# EAGLE design tx (EAGLE 6.5.0)
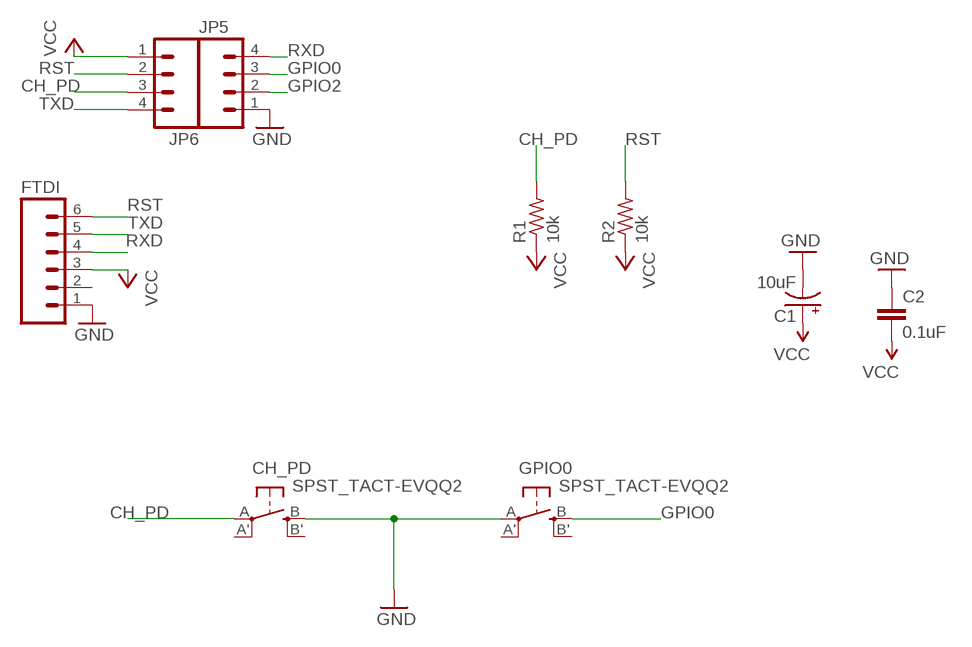
[diagram p0: schematic, sheet 1]

## Parts
C1  10uF  CAP_POL6032  [EIA6032]
C2  0.1uF  0.1UF-100V-10%(0603)  [0603-CAP]
CH_PD  SPST_TACT-EVQQ2  [EVQ-Q2]
FTDI  M06SILK_FEMALE_PTH  [1X06]
GPIO0  SPST_TACT-EVQQ2  [EVQ-Q2]
JP5  M041X04_NO_SILK  [1X04_NO_SILK]
JP6  M041X04_NO_SILK  [1X04_NO_SILK]
R1  10k  R-US_R0805  [R0805]
R2  10k  R-US_R0805  [R0805]

## Nets
CH_PD: CH_PD.A(P) JP6.3 R1.2
GND: C1.P$2(-) C2.1 CH_PD.B(S) FTDI.1 GPIO0.A(P) JP5.1
GPIO0: GPIO0.B(S) JP5.3
GPIO2: JP5.2
RST: FTDI.6 JP6.2 R2.2
RXD: FTDI.4 JP5.4
TXD: FTDI.5 JP6.4
VCC: C1.P$1(+) C2.2 FTDI.3 JP6.1 R1.1 R2.1
Unconnected: CH_PD.A'(P1) CH_PD.B'(S1) FTDI.2 GPIO0.A'(P1) GPIO0.B'(S1)

## Library data of the parts
C1 = SparkFun-Capacitors:CAP_POL: Capacitor Polarized These are standard SMD and PTH capacitors. Normally 10uF, 47uF, and 100uF in electrolytic and tantalum varieties. Always verify the external diameter of the through hole cap, it varies with capacity, voltage, and manufacturer. The EIA devices should be standard.
C2 = SparkFun-Capacitors:0.1UF-100V-10%(0603): CAP-08390; PROD_ID: CAP-08390
CH_PD GPIO0 = adafruit:SPST_TACT: SMT 6mm switch, EVQQ2 series http://www.ladyada.net/library/eagle
FTDI = SparkFun-Connectors:M06: Header 6 Standard 6-pin 0.1" header. Use with straight break away headers (SKU : PRT-00116), right angle break away headers (PRT-00553), swiss pins (PRT-00743), machine pins (PRT-00117), and female headers (PRT-00115). Molex polarized connector foot print use with SKU : PRT-08094 with associated crimp pins and housings. NOTES ON THE VARIANTS LOCK and LOCK_LONGPADS... This footprint was designed to help hold the alignment of a through-hole component (i.e. 6-pin header) while soldering it into place. You may notice that each hole has been shifted either up or down by 0.005 of an inch from it's more standard position (which is a perfectly straight line). This slight alteration caused the pins (the squares in the middle) to touch the edges of the holes. Because they are alternating, it causes a "brace" to hold the component in place. 0.005 has proven to be the perfect amount of "off-center" position when using our standard breakaway headers. Although looks a little odd when you look at the bare footprint, once you have a header in there, the alteration is very hard to notice. Also,if you push a header all the way into place, it is covered up entirely on the bottom side. This idea of altering the position of holes to aid alignment will be further integrated into the Sparkfun Library for other footprints. It can help hold any component with 3 or more connection pins.; PROD_ID: CONN-08437
JP5 JP6 = SparkFun-Connectors:M04: Header 4 Standard 4-pin 0.1" header. Use with straight break away headers (SKU : PRT-00116), right angle break away headers (PRT-00553), swiss pins (PRT-00743), machine pins (PRT-00117), and female headers (PRT-00115). Molex polarized connector foot print use with SKU : PRT-08231 with associated crimp pins and housings. 1MM SMD Version SKU: PRT-10208
R1 R2 = adafruit:R-US_: RESISTOR, American symbol

## Board
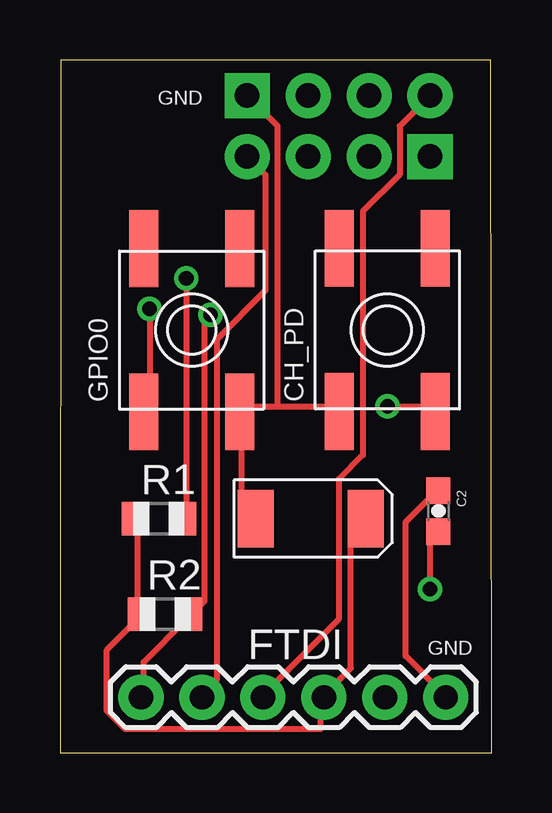
[diagram p1: board, top side]
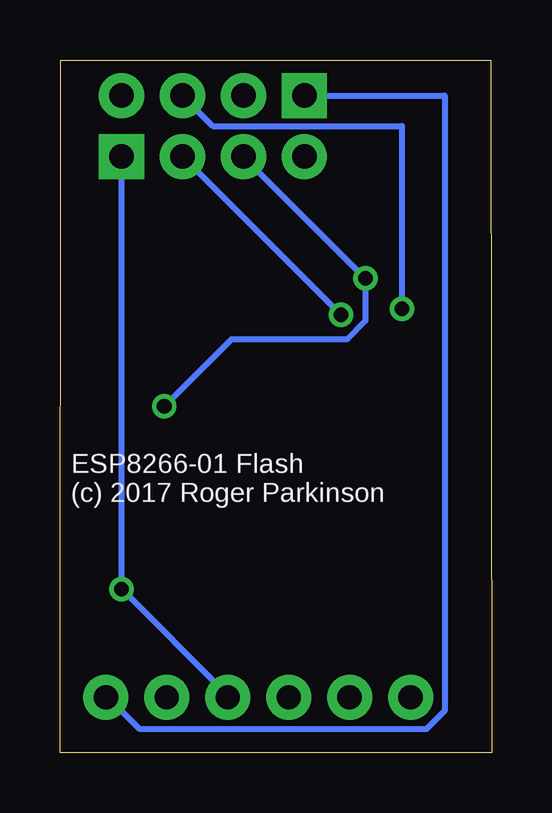
[diagram p2: board, bottom side, seen from below]

Size 17.98 x 28.89 mm. Coordinates in mm from the lower left corner, seen from the top.
Outline: 0,0 17.98,0.01 17.95,28.88 0.03,28.89 0,0
Copper layers (1*16): Top 0.035mm / dielectric 1.5mm / Bottom 0.035mm
Design rules "default": minimum track width 10mil, minimum drill 24mil, track to track 8mil, track to pad 8mil, pad to pad 8mil, via to via 8mil, smd to smd 8mil, copper to edge 40mil, drill to drill 8mil, minimum pad ring 10mil, minimum via ring 8mil, stop-mask expansion 4mil, vias tented up to drill 0mil, thermal gap 10mil

### Footprints (pad centres in the part's own frame; a part is rotated, then mirrored left to right if it is on the bottom)
EIA6032 = smd 1.5 x 2.4: P$1 -2.3,0; P$2 2.3,0
0603-CAP = smd 1.1 x 1: 1 -0.85,0; 2 0.85,0
EVQ-Q2 = smd 3.2 x 1.2: A -3.4,-2; A' 3.4,-2; B -3.4,2; B' 3.4,2
1X06 = drill 1.016 pad 1.88: 1 0,0; 2 2.54,0; 3 5.08,0; 4 7.62,0; 5 10.16,0; 6 12.7,0
1X04_NO_SILK = drill 1.016 pad 1.88 square: 1 0,0 | drill 1.016 pad 1.88: 2 2.54,0; 3 5.08,0; 4 7.62,0
R0805 = smd 1.1 x 1.4: 1 -1,0; 2 1,0

### Placement (x,y rotation side)
C1  10.45,9.77 180 top
C2  15.76,10.08 270 top
CH_PD  13.64,17.64 90 top
FTDI  16.07,2.32 180 top
GPIO0  5.48,17.63 90 top
JP5  7.8,27.41 0 top
JP6  15.42,24.87 180 top
R1  4.13,9.76 0 top
R2  4.38,5.78 0 top

### Tracks (layer width: path | path; a pad name or v marks a point on that pad's centre or on a via)
CH_PD  (via drill 0.61)
  Top 0.254: v5.26,19.79 5.26,9.88 R1.2 | v13.64,14.45 15.42,14.45 CH_PD.A
  Bottom 0.254: JP6.3 v5.26,19.79 5.26,18.01 6.02,17.25 10.85,17.25 v13.64,14.45
GND
  Top 0.254: C2.1 15.67,10.9 14.4,9.63 14.4,4.04 15.93,2.51 FTDI.1 | C1.P$2 8.05,9.88 7.54,10.39 7.54,14.2 GPIO0.A 7.54,14.45 9.07,14.45 | 9.07,14.45 11.61,14.45 CH_PD.B | JP5.1 9.07,26.14 9.07,14.45
  Bottom 0.254: JP5.1 1.96,27.41 1.96,1.75 2.72,0.99 14.66,0.99 15.93,2.26 FTDI.1
GPIO0  (via drill 0.61)
  Top 0.254: v3.73,18.52 3.73,14.45 GPIO0.B
  Bottom 0.254: v3.73,18.52 3.73,26.14 11.61,26.14 JP5.3
RST  (via drill 0.61)
  Top 0.254: FTDI.6 3.48,2.51 3.48,3.78 5.26,5.56 R2.2 5.51,5.82 6.02,6.32 6.02,18.01 v6.27,18.26
  Bottom 0.254: v6.27,18.26 JP6.2
RXD
  Top 0.254: JP5.4 14.15,26.14 14.15,24.1 12.62,22.58 12.62,12.42 11.61,11.4 11.61,5.56 8.56,2.51 FTDI.4
TXD
  Top 0.254: JP6.4 8.56,24.1 8.56,19.28 6.53,17.25 6.53,3.02 6.02,2.51 FTDI.5
VCC  (via drill 0.61)
  Top 0.254: R1.1 3.23,9.63 3.23,5.82 R2.1 3.23,5.56 1.96,4.29 1.96,1.75 2.72,0.99 10.85,0.99 10.85,2.26 FTDI.3 11.1,2.51 12.12,3.53 12.12,9.12 12.62,9.63 C1.P$1 | v15.42,6.83 15.42,8.86 15.67,9.12 C2.2
  Bottom 0.254: FTDI.3 11.1,2.51 v15.42,6.83 JP6.1

### Text on the board
tPlace: GND
tNames: GND
_bsilk: ESP8266-01 Flash / (c) 2017 Roger Parkinson